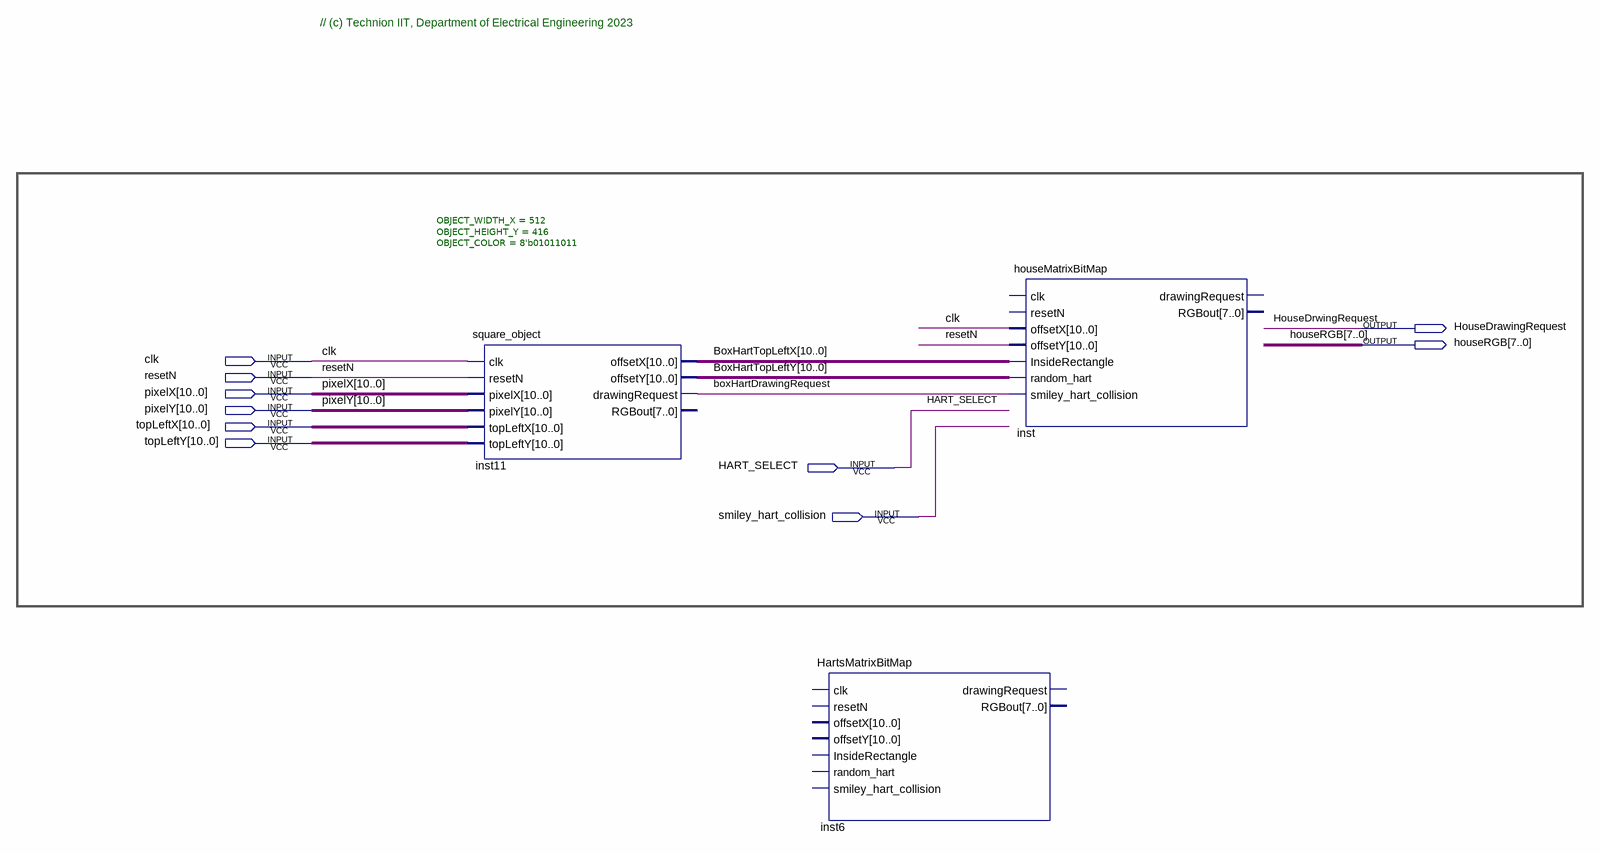
[diagram p0: schematic sheet]
// Quartus schematic HART_DISPLAY.bdf as structural Verilog: 3 symbols, 10 pins
module HART_DISPLAY (
  input  clk,
  input  resetN,
  input  [10:0] pixelX,
  input  [10:0] pixelY,
  input  [10:0] topLeftX,
  input  [10:0] topLeftY,
  input  HART_SELECT,
  input  smiley_hart_collision,
  output HouseDrawingRequest,
  output [7:0] houseRGB
);

  wire boxHartDrawingRequest;
  wire [10:0] BoxHartTopLeftX, BoxHartTopLeftY;

  square_object #(.OBJECT_WIDTH_X(512), .OBJECT_HEIGHT_Y(416), .OBJECT_COLOR(8'b01011011)) inst11 (
    .clk(clk), .resetN(resetN), .pixelX(pixelX), .pixelY(pixelY), .topLeftX(topLeftX), .topLeftY(topLeftY),
    .offsetX(BoxHartTopLeftX), .offsetY(BoxHartTopLeftY), .drawingRequest(boxHartDrawingRequest));  // open: RGBout
  HartsMatrixBitMap inst6 ();  // open: clk, resetN, offsetX, offsetY, InsideRectangle, random_hart, smiley_hart_collision, drawingRequest, RGBout
  houseMatrixBitMap inst (
    .offsetX({11{clk}}), .offsetY({11{resetN}}), .InsideRectangle(BoxHartTopLeftX),
    .random_hart(BoxHartTopLeftY), .smiley_hart_collision(boxHartDrawingRequest));  // open: clk, resetN, drawingRequest, RGBout

  // Other names for the same wires on the sheet: HouseDrwingRequest = HouseDrawingRequest

  // Notes on the sheet:
  //   // (c) Technion IIT, Department of Electrical Engineering 2023
endmodule
